# EAGLE design SensorBoard (EAGLE 7.7.0)
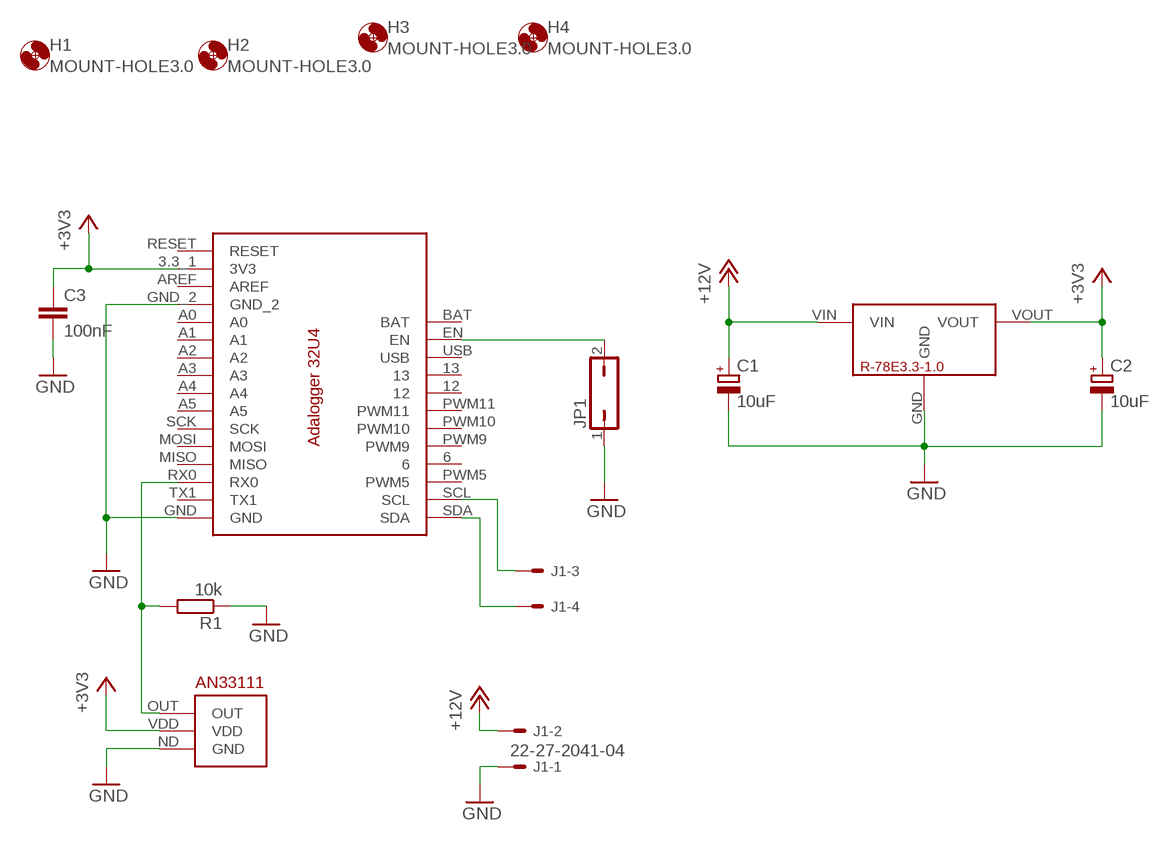
[diagram p0: schematic, sheet 1]

## Parts
C1  10uF  CPOL-EUE2.5-7  [E2,5-7]
C2  10uF  CPOL-EUE2.5-7  [E2,5-7]
C3  100nF  C-EU050-025X075  [C050-025X075]
H1  MOUNT-HOLE3.0  [3,0]
H2  MOUNT-HOLE3.0  [3,0]
H3  MOUNT-HOLE3.0  [3,0]
H4  MOUNT-HOLE3.0  [3,0]
J1  22-27-2041-04  [6410-04]
JP1  JP1Q  [JP1]
R1  10k  R-EU_0207/7  [0207/7]
U$1  ADALOGGER_32U4_BOARD  [ADALOGGER_32U4_BOARD]
U$2  AMN33111  [AN33111]
U$3  R-78E3.3-1.0  [R-78E3.3-1.0]

## Nets
+3V3: C2.+ C3.1 U$1.3.3_1(3V3) U$2.VDD U$3.VOUT
+12V: C1.+ J1.2 U$3.VIN
GND: C1.- C2.- C3.2 J1.1 JP1.1 R1.1 U$1.GND U$1.GND_2 U$2.ND(GND) U$3.GND
N$4: R1.2 U$1.RX0 U$2.OUT
N$6: JP1.2 U$1.EN
SCL: J1.3 U$1.SCL
SDA: J1.4 U$1.SDA
Unconnected: U$1.6 U$1.12 U$1.13 U$1.A0 U$1.A1 U$1.A2 U$1.A3 U$1.A4 U$1.A5 U$1.AREF U$1.BAT U$1.MISO U$1.MOSI U$1.PWM5 U$1.PWM9 U$1.PWM10 U$1.PWM11 U$1.RESET U$1.SCK U$1.TX1 U$1.USB

## Library data of the parts
C1 C2 = rcl:CPOL-EU: POLARIZED CAPACITOR, European symbol
C3 = rcl:C-EU: CAPACITOR, European symbol
H1-H4 = holes:MOUNT-HOLE: MOUNTING HOLE with drill center marker
J1 = con-molex:22-?-04: CONNECTOR wire to board 2.54 mm (.1 inch) pitch header; OC_FARNELL: unknown; OC_NEWARK: unknown
JP1 = jumper:JP1Q: JUMPER
R1 = rcl:R-EU_: RESISTOR, European symbol
U$1 = Carlos_Peoplecounter:ADALOGGER_32U4_BOARD
U$2 = Carlos_Peoplecounter:AMN33111
U$3 = Carlos_Peoplecounter:R-78E3.3-1.0

## Board
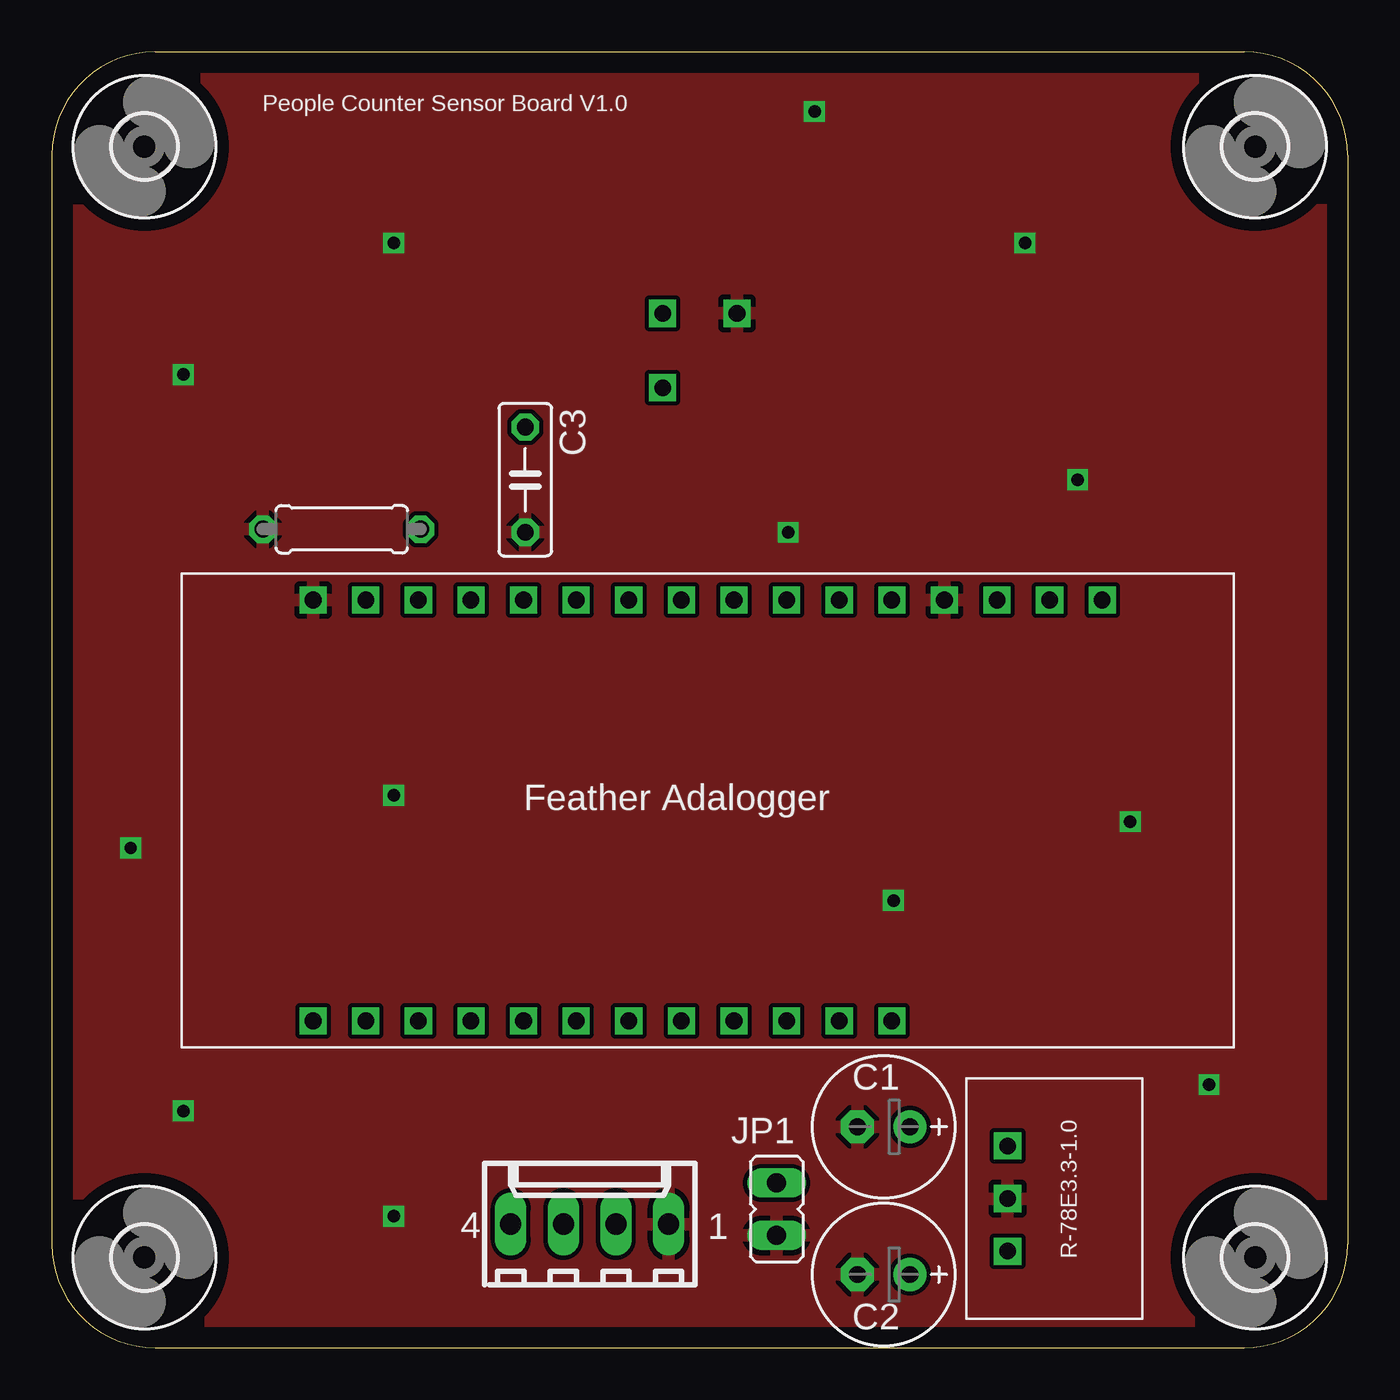
[diagram p1: board, top side]
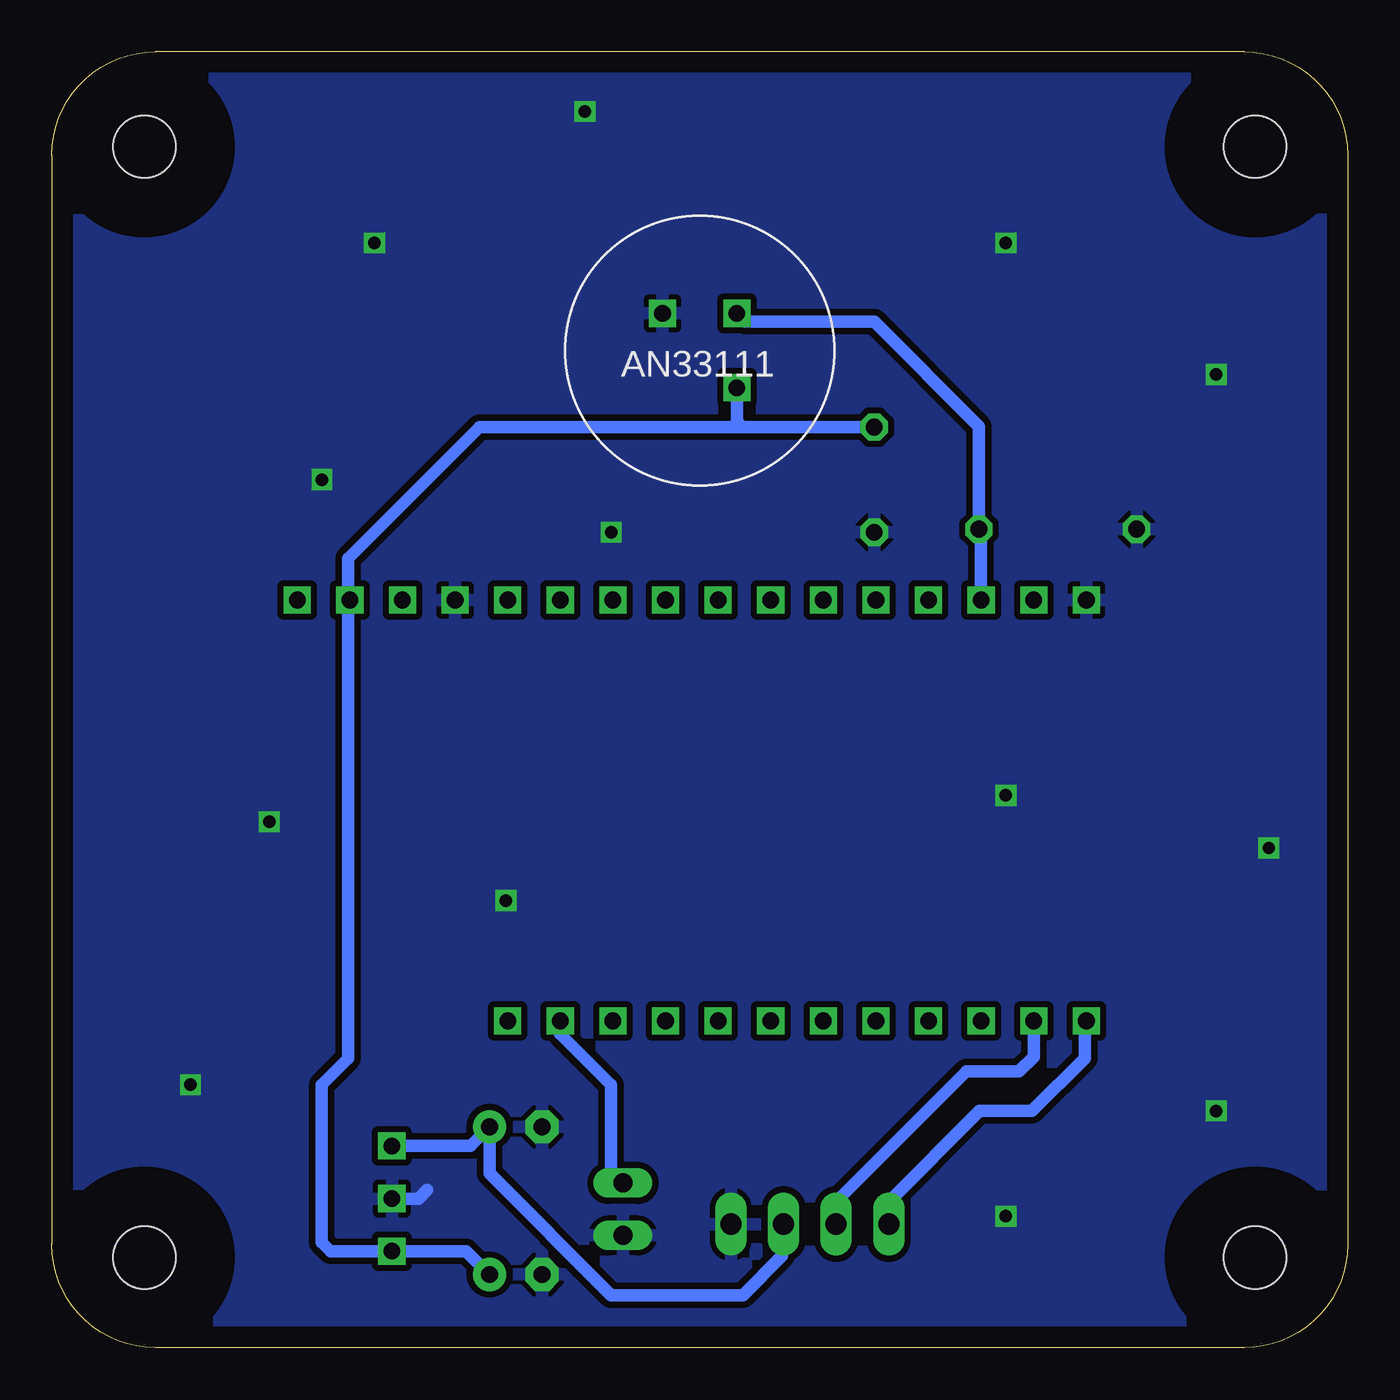
[diagram p2: board, bottom side, seen from below]

Size 62.57 x 62.57 mm. Coordinates in mm from the lower left corner, seen from the top.
Outline: 0,57.57 0,5 arc90 5,0 57.57,0 arc90 62.57,5 62.57,57.57 arc90 57.57,62.57 5,62.57 arc90 0,57.57
Copper layers (1*16): Top 0.035mm / dielectric 1.5mm / Bottom 0.035mm
Design rules "default": minimum track width 10mil, minimum drill 24mil, track to track 8mil, track to pad 8mil, pad to pad 8mil, via to via 8mil, smd to smd 8mil, copper to edge 40mil, drill to drill 8mil, minimum pad ring 10mil, minimum via ring 8mil, stop-mask expansion 4mil, vias tented up to drill 0mil, thermal gap 10mil

### Footprints (pad centres in the part's own frame; a part is rotated, then mirrored left to right if it is on the bottom)
E2,5-7 = drill 0.813 pad 1.6: + -1.27,0 | drill 0.813 pad 1.6 octagon: - 1.27,0
C050-025X075 = drill 0.813 octagon: 1 -2.54,0; 2 2.54,0
3,0 = hole 3: 0,0
6410-04 = drill 1.016 long: 1 3.81,0; 2 1.27,0; 3 -1.27,0; 4 -3.81,0
JP1 = drill 0.914 long: 1 0,-1.27; 2 0,1.27
0207/7 = drill 0.813 octagon: 1 -3.81,0; 2 3.81,0
ADALOGGER_32U4_BOARD = drill 0.8 square: 3.3_1 1.27,41.91; 6 21.59,13.97; 12 21.59,24.13; 13 21.59,26.67; A0 1.27,34.29; A1 1.27,31.75; A2 1.27,29.21; A3 1.27,26.67; A4 1.27,24.13; A5 1.27,21.59; AREF 1.27,39.37; BAT 21.59,34.29; EN 21.59,31.75; GND 1.27,6.35; GND_2 1.27,36.83; MISO 1.27,13.97; MOSI 1.27,16.51; PWM5 21.59,11.43; PWM9 21.59,16.51; PWM10 21.59,19.05; PWM11 21.59,21.59; RESET 1.27,44.45; RX0 1.27,11.43; SCK 1.27,19.05; SCL 21.59,8.89; SDA 21.59,6.35; TX1 1.27,8.89; USB 21.59,29.21
AN33111 = drill 0.8 square: ND -1.796,1.796; OUT 1.796,1.796; VDD 1.796,-1.796
R-78E3.3-1.0 = drill 0.8 square: GND 0,0; VIN -2.54,0; VOUT 2.54,0

### Placement (x,y rotation side)
C1  40.16,10.66 180 top
C2  40.16,3.54 180 top
C3  22.86,41.91 270 top
H1  4.47,4.36 0 top
H2  58.1,4.36 0 top
H3  58.1,57.99 0 top
H4  4.47,57.99 0 top
J1  25.97,5.97 0 top
JP1  35,6.69 0 top
R1  14,39.52 0 top
U$1  6.27,37.37 270 top
U$2  31.29,48.14 0 bottom
U$3  46.15,7.2 270 top

### Tracks (layer width: path | path; a pad name or v marks a point on that pad's centre or on a via)
+3V3
  Bottom 0.61: C2.+ 42.56,4.66 U$3.VOUT 49.11,4.66 49.53,5.08 49.53,12.7 48.26,13.97 48.26,36.02 U$1.3.3_1 48.26,36.18 48.26,38.1 41.91,44.45 29.21,44.45 | C3.1 29.21,44.45 | U$2.VDD 29.49,44.73 29.21,44.45
+12V
  Bottom 0.61: U$3.VIN 42.36,9.74 C1.+ 41.44,8.41 35.56,2.54 29.21,2.54 27.3,4.45 27.3,5.91 J1.2
GND  (via drill 0.6)
  Bottom 0.61: U$3.GND 44.87,7.2 44.45,7.62
  other vias: 36.83,59.69 46.99,53.34 49.53,41.91 16.51,53.34 6.35,46.99 3.81,24.13 16.51,26.67 6.35,11.43 16.51,6.35 52.07,25.4 55.88,12.7 40.64,21.59 35.56,39.37
  pour Bottom (isolate 0.305): -2,64 64,64 64,-3 -2,-3
  pour Top: 1.27,63.5 63.5,63.5 63.5,-1.27 -1.27,-1.27 -1.27,63.5
N$4
  Bottom 0.61: U$1.RX0 17.7,39.41 R1.2 17.81,44.48 22.86,49.53 29.08,49.53 U$2.OUT
N$6
  Bottom 0.61: U$1.EN 38.02,15.16 35.56,12.7 35.56,8.52 JP1.2
SCL
  Bottom 0.61: U$1.SCL 15.16,14.05 15.88,13.34 18.41,13.34 24.77,6.99 24.77,6.04 J1.3
SDA
  Bottom 0.61: J1.4 22.16,7.05 17.78,11.43 15.24,11.43 12.7,13.97 12.7,15.7 U$1.SDA

### Text on the board
tPlace: People Counter Sensor Board V1.0